# EAGLE design Teensy3.6Breakout (EAGLE 8.7.0)
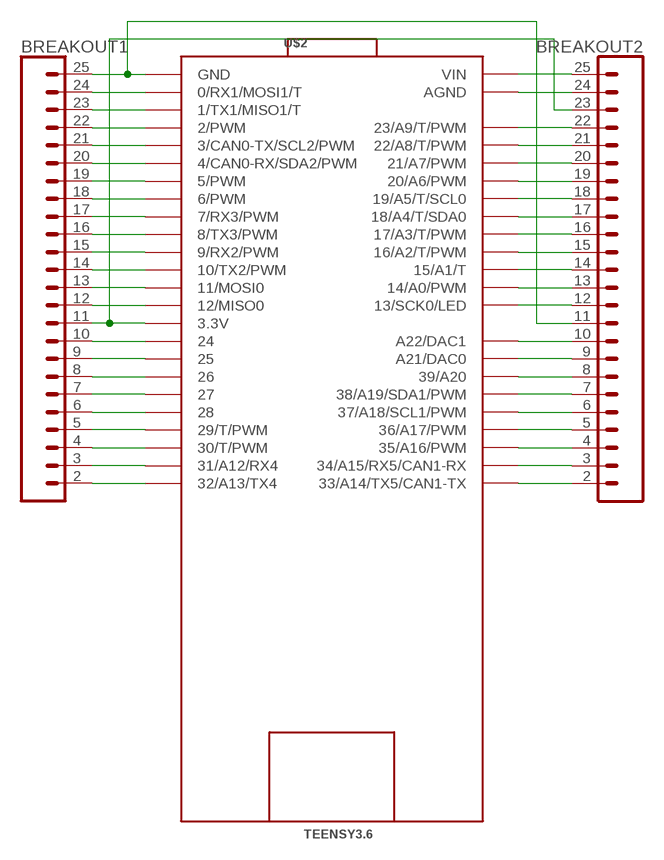
[diagram p0: schematic, sheet 1]

## Parts
BREAKOUT1  CONN_24LONGPADS  [1X24_LONGPADS]
BREAKOUT2  CONN_24LONGPADS  [1X24_LONGPADS]
U$2  TEENSY3.6  [TEENSY3.6]

## Nets
N$1: BREAKOUT1.25 BREAKOUT2.11 U$2.GND U$2.GND1(GND)
N$2: BREAKOUT1.24 U$2.0(0/RX1/MOSI1/T)
N$3: BREAKOUT1.23 U$2.1(1/TX1/MISO1/T)
N$4: BREAKOUT1.22 U$2.2(2/PWM)
N$5: BREAKOUT1.21 U$2.3(3/CAN0-TX/SCL2/PWM)
N$6: BREAKOUT1.20 U$2.4(4/CAN0-RX/SDA2/PWM)
N$7: BREAKOUT1.19 U$2.5(5/PWM)
N$8: BREAKOUT1.18 U$2.6(6/PWM)
N$9: BREAKOUT1.17 U$2.7(7/RX3/PWM)
N$10: BREAKOUT1.16 U$2.8(8/TX3/PWM)
N$11: BREAKOUT1.15 U$2.9(9/RX2/PWM)
N$12: BREAKOUT1.14 U$2.10(10/TX2/PWM)
N$13: BREAKOUT1.13 U$2.11(11/MOSI0)
N$14: BREAKOUT1.12 U$2.12(12/MISO0)
N$15: BREAKOUT1.11 BREAKOUT2.23 U$2.3.3V U$2.3.3V3(3.3V)
N$16: BREAKOUT1.10 U$2.24
N$17: BREAKOUT1.9 U$2.25
N$18: BREAKOUT1.8 U$2.26
N$19: BREAKOUT1.7 U$2.27
N$20: BREAKOUT1.6 U$2.28
N$21: BREAKOUT1.5 U$2.29(29/T/PWM)
N$22: BREAKOUT1.4 U$2.30(30/T/PWM)
N$23: BREAKOUT1.3 U$2.31/A12(31/A12/RX4)
N$24: BREAKOUT1.2 U$2.32/A13(32/A13/TX4)
N$25: BREAKOUT2.8 U$2.39/A20
N$26: BREAKOUT2.7 U$2.38/A19(38/A19/SDA1/PWM)
N$27: BREAKOUT2.6 U$2.37/A18(37/A18/SCL1/PWM)
N$28: BREAKOUT2.5 U$2.36/A17(36/A17/PWM)
N$29: BREAKOUT2.4 U$2.35/A16(35/A16/PWM)
N$30: BREAKOUT2.3 U$2.34/A15(34/A15/RX5/CAN1-RX)
N$31: BREAKOUT2.2 U$2.33/A14(33/A14/TX5/CAN1-TX)
N$32: BREAKOUT2.9 U$2.A21(A21/DAC0)
N$33: BREAKOUT2.10 U$2.A22(A22/DAC1)
N$34: BREAKOUT2.12 U$2.13(13/SCK0/LED)
N$35: BREAKOUT2.13 U$2.14/A0(14/A0/PWM)
N$36: BREAKOUT2.14 U$2.15/A1(15/A1/T)
N$37: BREAKOUT2.15 U$2.16/A2(16/A2/T/PWM)
N$38: BREAKOUT2.16 U$2.17/A3(17/A3/T/PWM)
N$39: BREAKOUT2.17 U$2.18/A4(18/A4/T/SDA0)
N$40: BREAKOUT2.18 U$2.19/A5(19/A5/T/SCL0)
N$41: BREAKOUT2.19 U$2.20/A6(20/A6/PWM)
N$42: BREAKOUT2.20 U$2.21/A7(21/A7/PWM)
N$43: BREAKOUT2.21 U$2.22/A8(22/A8/T/PWM)
N$44: BREAKOUT2.22 U$2.23/A9(23/A9/T/PWM)
N$45: BREAKOUT2.24 U$2.AGND
N$46: BREAKOUT2.25 U$2.P$1(VIN) U$2.VIN

## Library data of the parts
BREAKOUT1 BREAKOUT2 = SparkFun-Connectors:CONN_24: Multi connection point. Often used as Generic Header-pin footprint for 0.1 inch spaced/style header connections On any of the 0.1 inch spaced packages, you can populate with these: Break Away Headers - Straight <https://www.sparkfun.com/products/116> (PRT-00116) Break Away Male Headers - Right Angle <https://www.sparkfun.com/products/553> (PRT-00553) Female Headers <https://www.sparkfun.com/products/115> (PRT-00115) Break Away Headers - Machine Pin <https://www.sparkfun.com/products/117> (PRT-00117) Break Away Female Headers - Swiss Machine Pin <https://www.sparkfun.com/products/743> (PRT-00743) For SCREWTERMINALS and SPRING TERMINALS visit here: Screw Terimnals on SparkFun.com <https://www.sparkfun.com/search/results?term=Screw+Terminals> (5mm/3.5mm/2.54mm spacing) This device is also useful as a general connection point to wire up your design to another part of your project. Our various solder wires solder well into these plated through hole pads. Hook-Up Wire - Assortment (Stranded, 22 AWG) <https://www.sparkfun.com/products/11375> (PRT-11375) Hook-Up Wire - Assortment (Solid Core, 22 AWG) <https://www.sparkfun.com/products/11367> (PRT-11367) View the entire wire category on our website here <https://www.sparkfun.com/categories/141> Special notes: Molex polarized connector foot print use with SKU : PRT-08231 with associated crimp pins and housings. 1MM SMD Version SKU: PRT-10208 NOTES ON THE VARIANTS LOCK and LOCK_LONGPADS... This footprint was designed to help hold the alignment of a through-hole component (i.e. 6-pin header) while soldering it into place. You may notice that each hole has been shifted either up or down by 0.005 of an inch from it's more standard position (which is a perfectly straight line). This slight alteration caused the pins (the squares in the middle) to touch the edges of the holes. Because they are alternating, it causes a "brace" to hold the component in place. 0.005 has proven to be the perfect amount of "off-center" position when using our standard breakaway headers. Although looks a little odd when you look at the bare footprint, once you have a header in there, the alteration is very hard to notice. Also,if you push a header all the way into place, it is covered up entirely on the bottom side.
U$2 = Teensy_3_and_LC_Series_Boards_v1.4:TEENSY3.6

## Board
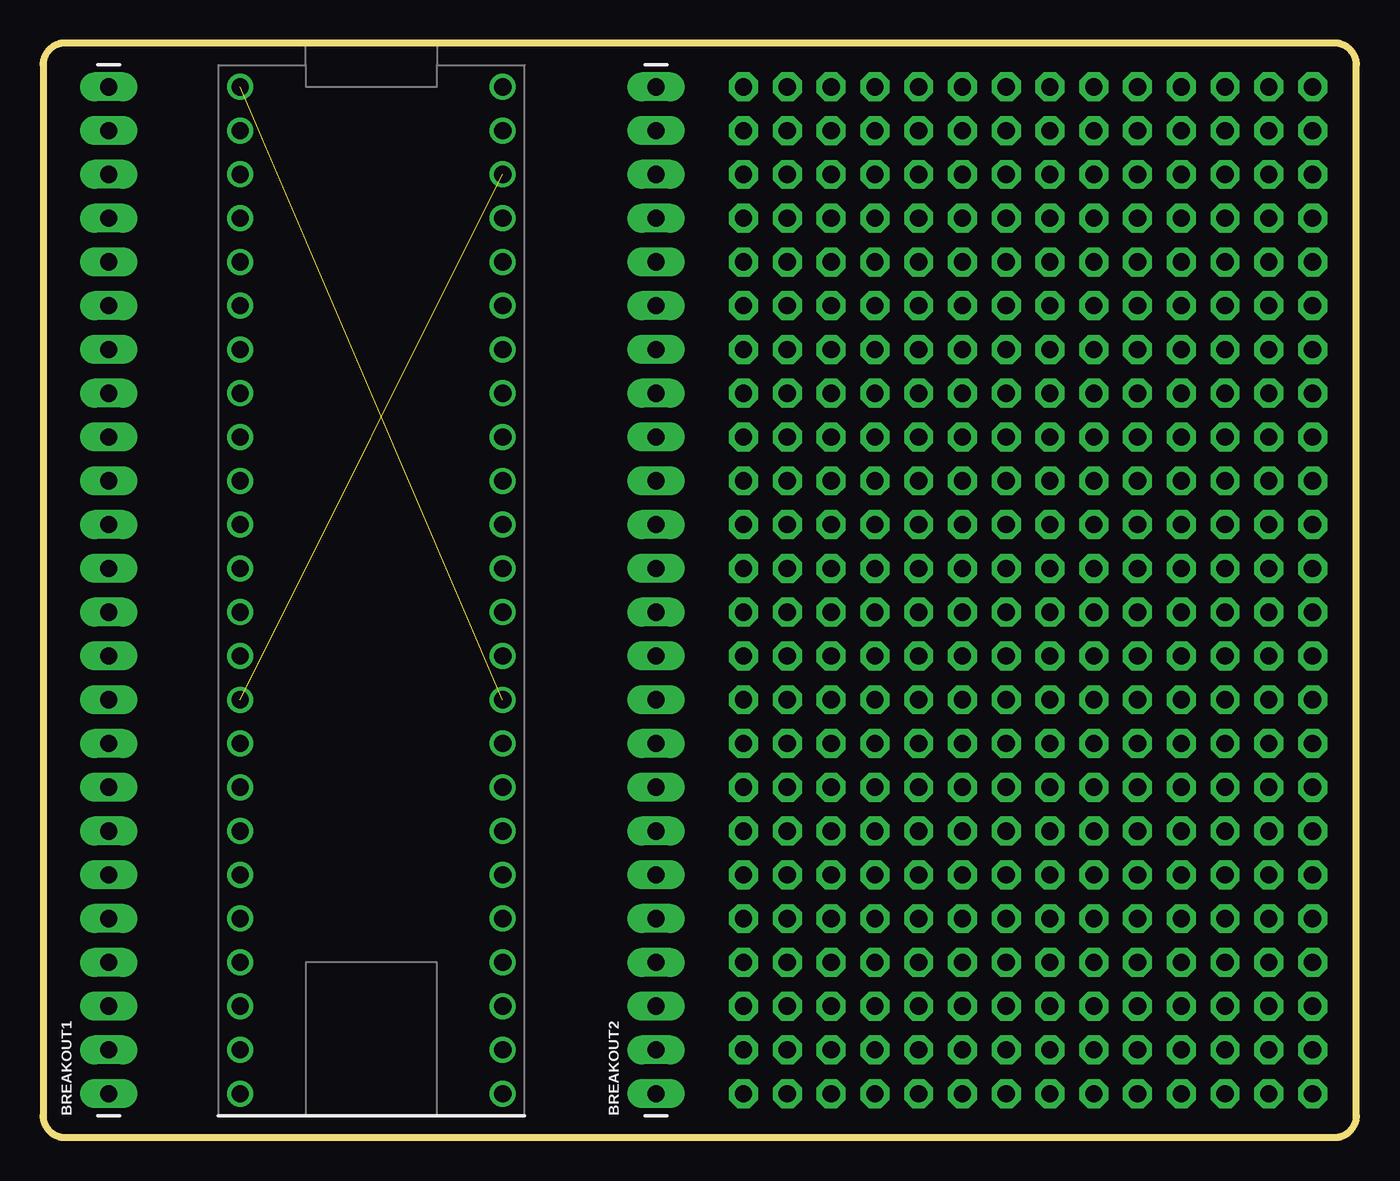
[diagram p1: board, top side]
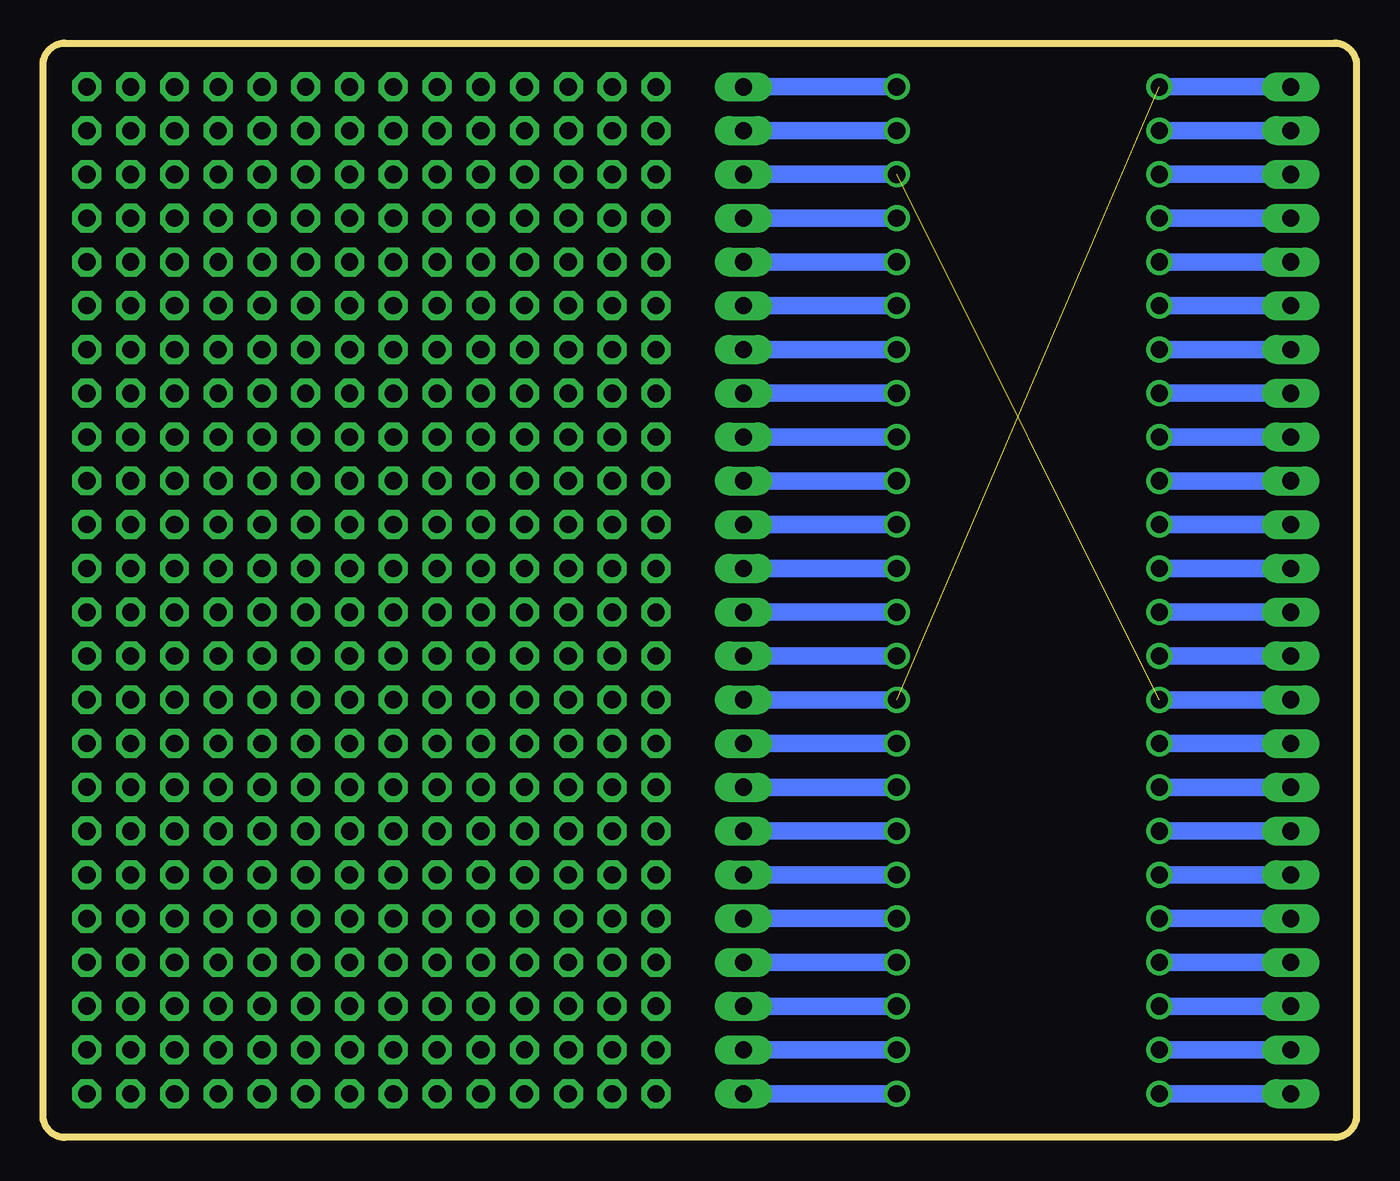
[diagram p2: board, bottom side, seen from below]

Size 76.2 x 63.5 mm. Coordinates in mm from the lower left corner, seen from the top.
Outline: 0,62.23 0,1.27 arc90 1.27,0 74.93,0 arc90 76.2,1.27 76.2,62.23 arc90 74.93,63.5 1.27,63.5 arc90 0,62.23
Copper layers (1*16): Top 0.035mm / dielectric 1.5mm / Bottom 0.035mm
Design rules "default": minimum track width 6mil, minimum drill 0.35mm, track to track 6mil, track to pad 6mil, pad to pad 6mil, via to via 6mil, smd to smd 6mil, copper to edge 40mil, drill to drill 6mil, minimum pad ring 10mil, minimum via ring 8mil, stop-mask expansion 4mil, vias tented up to drill 0mil, thermal gap 10mil

### Footprints (pad centres in the part's own frame; a part is rotated, then mirrored left to right if it is on the bottom)
1X24_LONGPADS = drill 1 pad 1.676 long: 2 -26.67,0; 3 -24.13,0; 4 -21.59,0; 5 -19.05,0; 6 -16.51,0; 7 -13.97,0; 8 -11.43,0; 9 -8.89,0; 10 -6.35,0; 11 -3.81,0; 12 -1.27,0; 13 1.27,0; 14 3.81,0; 15 6.35,0; 16 8.89,0; 17 11.43,0; 18 13.97,0; 19 16.51,0; 20 19.05,0; 21 21.59,0; 22 24.13,0; 23 26.67,0; 24 29.21,0; 25 31.75,0
TEENSY3.6 = drill 1: 0 -7.62,19.05; 1 -7.62,16.51; 2 -7.62,13.97; 3 -7.62,11.43; 3.3V 7.62,16.51; 3.3V3 -7.62,-13.97; 4 -7.62,8.89; 5 -7.62,6.35; 6 -7.62,3.81; 7 -7.62,1.27; 8 -7.62,-1.27; 9 -7.62,-3.81; 10 -7.62,-6.35; 11 -7.62,-8.89; 12 -7.62,-11.43; 13 7.62,-11.43; 14/A0 7.62,-8.89; 15/A1 7.62,-6.35; 16/A2 7.62,-3.81; 17/A3 7.62,-1.27; 18/A4 7.62,1.27; 19/A5 7.62,3.81; 20/A6 7.62,6.35; 21/A7 7.62,8.89; 22/A8 7.62,11.43; 23/A9 7.62,13.97; 24 -7.62,-16.51; 25 -7.62,-19.05; 26 -7.62,-21.59; 27 -7.62,-24.13; 28 -7.62,-26.67; 29 -7.62,-29.21; 30 -7.62,-31.75; 31/A12 -7.62,-34.29; 32/A13 -7.62,-36.83; 33/A14 7.62,-36.83; 34/A15 7.62,-34.29; 35/A16 7.62,-31.75; 36/A17 7.62,-29.21; 37/A18 7.62,-26.67; 38/A19 7.62,-24.13; 39/A20 7.62,-21.59; A21 7.62,-19.05; A22 7.62,-16.51; AGND 7.62,19.05; GND -7.62,21.59; GND1 7.62,-13.97; VIN 7.62,21.59 | drill 1 pad 1.676 octagon: P$1 21.59,21.59; P$2 24.13,21.59; P$3 26.67,21.59; P$4 29.21,21.59; P$5 31.75,21.59; P$6 34.29,21.59; P$7 36.83,21.59; P$8 39.37,21.59; P$9 41.91,21.59; P$10 44.45,21.59; P$11 46.99,21.59; P$12 49.53,21.59; P$13 52.07,21.59; P$14 54.61,21.59; P$15 21.59,19.05; P$16 24.13,19.05; P$17 26.67,19.05; P$18 29.21,19.05; P$19 31.75,19.05; P$20 34.29,19.05; P$21 36.83,19.05; P$22 39.37,19.05; P$23 41.91,19.05; P$24 44.45,19.05; P$25 46.99,19.05; P$26 49.53,19.05; P$27 52.07,19.05; P$28 54.61,19.05; P$29 21.59,16.51; P$30 24.13,16.51; P$31 26.67,16.51; P$32 29.21,16.51; P$33 31.75,16.51; P$34 34.29,16.51; P$35 36.83,16.51; P$36 39.37,16.51; P$37 41.91,16.51; P$38 44.45,16.51; P$39 46.99,16.51; P$40 49.53,16.51; P$41 52.07,16.51; P$42 54.61,16.51; P$43 21.59,13.97; P$44 24.13,13.97; P$45 26.67,13.97; P$46 29.21,13.97; P$47 31.75,13.97; P$48 34.29,13.97; P$49 36.83,13.97; P$50 39.37,13.97; P$51 41.91,13.97; P$52 44.45,13.97; P$53 46.99,13.97; P$54 49.53,13.97; P$55 52.07,13.97; P$56 54.61,13.97; P$57 21.59,11.43; P$58 24.13,11.43; P$59 26.67,11.43; P$60 29.21,11.43; P$61 31.75,11.43; P$62 34.29,11.43; P$63 36.83,11.43; P$64 39.37,11.43; P$65 41.91,11.43; P$66 44.45,11.43; P$67 46.99,11.43; P$68 49.53,11.43; P$69 52.07,11.43; P$70 54.61,11.43; P$71 21.59,8.89; P$72 24.13,8.89; P$73 26.67,8.89; P$74 29.21,8.89; P$75 31.75,8.89; P$76 34.29,8.89; P$77 36.83,8.89; P$78 39.37,8.89; P$79 41.91,8.89; P$80 44.45,8.89; P$81 46.99,8.89; P$82 49.53,8.89; P$83 52.07,8.89; P$84 54.61,8.89; P$85 21.59,6.35; P$86 24.13,6.35; P$87 26.67,6.35; P$88 29.21,6.35; P$89 31.75,6.35; P$90 34.29,6.35; P$91 36.83,6.35; P$92 39.37,6.35; P$93 41.91,6.35; P$94 44.45,6.35; P$95 46.99,6.35; P$96 49.53,6.35; P$97 52.07,6.35; P$98 54.61,6.35; P$99 21.59,3.81; P$100 24.13,3.81; P$101 26.67,3.81; P$102 29.21,3.81; P$103 31.75,3.81; P$104 34.29,3.81; P$105 36.83,3.81; P$106 39.37,3.81; P$107 41.91,3.81; P$108 44.45,3.81; P$109 46.99,3.81; P$110 49.53,3.81; P$111 52.07,3.81; P$112 54.61,3.81; P$113 21.59,1.27; P$114 24.13,1.27; P$115 26.67,1.27; P$116 29.21,1.27; P$117 31.75,1.27; P$118 34.29,1.27; P$119 36.83,1.27; P$120 39.37,1.27; P$121 41.91,1.27; P$122 44.45,1.27; P$123 46.99,1.27; P$124 49.53,1.27; P$125 52.07,1.27; P$126 54.61,1.27; P$127 21.59,-1.27; P$128 24.13,-1.27; P$129 26.67,-1.27; P$130 29.21,-1.27; P$131 31.75,-1.27; P$132 34.29,-1.27; P$133 36.83,-1.27; P$134 39.37,-1.27; P$135 41.91,-1.27; P$136 44.45,-1.27; P$137 46.99,-1.27; P$138 49.53,-1.27; P$139 52.07,-1.27; P$140 54.61,-1.27; P$141 21.59,-3.81; P$142 24.13,-3.81; P$143 26.67,-3.81; P$144 29.21,-3.81; P$145 31.75,-3.81; P$146 34.29,-3.81; P$147 36.83,-3.81; P$148 39.37,-3.81; P$149 41.91,-3.81; P$150 44.45,-3.81; P$151 46.99,-3.81; P$152 49.53,-3.81; P$153 52.07,-3.81; P$154 54.61,-3.81; P$155 21.59,-6.35; P$156 24.13,-6.35; P$157 26.67,-6.35; P$158 29.21,-6.35; P$159 31.75,-6.35; P$160 34.29,-6.35; P$161 36.83,-6.35; P$162 39.37,-6.35; P$163 41.91,-6.35; P$164 44.45,-6.35; P$165 46.99,-6.35; P$166 49.53,-6.35; P$167 52.07,-6.35; P$168 54.61,-6.35; P$169 21.59,-8.89; P$170 24.13,-8.89; P$171 26.67,-8.89; P$172 29.21,-8.89; P$173 31.75,-8.89; P$174 34.29,-8.89; P$175 36.83,-8.89; P$176 39.37,-8.89; P$177 41.91,-8.89; P$178 44.45,-8.89; P$179 46.99,-8.89; P$180 49.53,-8.89; P$181 52.07,-8.89; P$182 54.61,-8.89; P$183 21.59,-11.43; P$184 24.13,-11.43; P$185 26.67,-11.43; P$186 29.21,-11.43; P$187 31.75,-11.43; P$188 34.29,-11.43; P$189 36.83,-11.43; P$190 39.37,-11.43; P$191 41.91,-11.43; P$192 44.45,-11.43; P$193 46.99,-11.43; P$194 49.53,-11.43; P$195 52.07,-11.43; P$196 54.61,-11.43; P$197 21.59,-13.97; P$198 24.13,-13.97; P$199 26.67,-13.97; P$200 29.21,-13.97; P$201 31.75,-13.97; P$202 34.29,-13.97; P$203 36.83,-13.97; P$204 39.37,-13.97; P$205 41.91,-13.97; P$206 44.45,-13.97; P$207 46.99,-13.97; P$208 49.53,-13.97; P$209 52.07,-13.97; P$210 54.61,-13.97; P$211 21.59,-16.51; P$212 24.13,-16.51; P$213 26.67,-16.51; P$214 29.21,-16.51; P$215 31.75,-16.51; P$216 34.29,-16.51; P$217 36.83,-16.51; P$218 39.37,-16.51; P$219 41.91,-16.51; P$220 44.45,-16.51; P$221 46.99,-16.51; P$222 49.53,-16.51; P$223 52.07,-16.51; P$224 54.61,-16.51; P$225 21.59,-19.05; P$226 24.13,-19.05; P$227 26.67,-19.05; P$228 29.21,-19.05; P$229 31.75,-19.05; P$230 34.29,-19.05; P$231 36.83,-19.05; P$232 39.37,-19.05; P$233 41.91,-19.05; P$234 44.45,-19.05; P$235 46.99,-19.05; P$236 49.53,-19.05; P$237 52.07,-19.05; P$238 54.61,-19.05; P$239 21.59,-21.59; P$240 24.13,-21.59; P$241 26.67,-21.59; P$242 29.21,-21.59; P$243 31.75,-21.59; P$244 34.29,-21.59; P$245 36.83,-21.59; P$246 39.37,-21.59; P$247 41.91,-21.59; P$248 44.45,-21.59; P$249 46.99,-21.59; P$250 49.53,-21.59; P$251 52.07,-21.59; P$252 54.61,-21.59; P$253 21.59,-24.13; P$254 24.13,-24.13; P$255 26.67,-24.13; P$256 29.21,-24.13; P$257 31.75,-24.13; P$258 34.29,-24.13; P$259 36.83,-24.13; P$260 39.37,-24.13; P$261 41.91,-24.13; P$262 44.45,-24.13; P$263 46.99,-24.13; P$264 49.53,-24.13; P$265 52.07,-24.13; P$266 54.61,-24.13; P$267 21.59,-26.67; P$268 24.13,-26.67; P$269 26.67,-26.67; P$270 29.21,-26.67; P$271 31.75,-26.67; P$272 34.29,-26.67; P$273 36.83,-26.67; P$274 39.37,-26.67; P$275 41.91,-26.67; P$276 44.45,-26.67; P$277 46.99,-26.67; P$278 49.53,-26.67; P$279 52.07,-26.67; P$280 54.61,-26.67; P$281 21.59,-29.21; P$282 24.13,-29.21; P$283 26.67,-29.21; P$284 29.21,-29.21; P$285 31.75,-29.21; P$286 34.29,-29.21; P$287 36.83,-29.21; P$288 39.37,-29.21; P$289 41.91,-29.21; P$290 44.45,-29.21; P$291 46.99,-29.21; P$292 49.53,-29.21; P$293 52.07,-29.21; P$294 54.61,-29.21; P$295 21.59,-31.75; P$296 24.13,-31.75; P$297 26.67,-31.75; P$298 29.21,-31.75; P$299 31.75,-31.75; P$300 34.29,-31.75; P$301 36.83,-31.75; P$302 39.37,-31.75; P$303 41.91,-31.75; P$304 44.45,-31.75; P$305 46.99,-31.75; P$306 49.53,-31.75; P$307 52.07,-31.75; P$308 54.61,-31.75; P$309 21.59,-34.29; P$310 24.13,-34.29; P$311 26.67,-34.29; P$312 29.21,-34.29; P$313 31.75,-34.29; P$314 34.29,-34.29; P$315 36.83,-34.29; P$316 39.37,-34.29; P$317 41.91,-34.29; P$318 44.45,-34.29; P$319 46.99,-34.29; P$320 49.53,-34.29; P$321 52.07,-34.29; P$322 54.61,-34.29; P$323 21.59,-36.83; P$324 24.13,-36.83; P$325 26.67,-36.83; P$326 29.21,-36.83; P$327 31.75,-36.83; P$328 34.29,-36.83; P$329 36.83,-36.83; P$330 39.37,-36.83; P$331 41.91,-36.83; P$332 44.45,-36.83; P$333 46.99,-36.83; P$334 49.53,-36.83; P$335 52.07,-36.83; P$336 54.61,-36.83

### Placement (x,y rotation side)
BREAKOUT1  3.81,29.21 90 top
BREAKOUT2  35.56,29.21 90 top
U$2  19.05,39.37 0 top

### Tracks (layer width: path | path; a pad name or v marks a point on that pad's centre or on a via)
N$1  (1 unrouted)
  Bottom 1.016: U$2.GND1 BREAKOUT2.11 | BREAKOUT1.25 U$2.GND
N$2
  Bottom 1.016: U$2.0 BREAKOUT1.24
N$3
  Bottom 1.016: BREAKOUT1.23 U$2.1
N$4
  Bottom 1.016: U$2.2 BREAKOUT1.22
N$5
  Bottom 1.016: BREAKOUT1.21 U$2.3
N$6
  Bottom 1.016: U$2.4 BREAKOUT1.20
N$7
  Bottom 1.016: BREAKOUT1.19 U$2.5
N$8
  Bottom 1.016: U$2.6 BREAKOUT1.18
N$9
  Bottom 1.016: BREAKOUT1.17 U$2.7
N$10
  Bottom 1.016: U$2.8 BREAKOUT1.16
N$11
  Bottom 1.016: BREAKOUT1.15 U$2.9
N$12
  Bottom 1.016: U$2.10 BREAKOUT1.14
N$13
  Bottom 1.016: BREAKOUT1.13 U$2.11
N$14
  Bottom 1.016: U$2.12 BREAKOUT1.12
N$15  (1 unrouted)
  Bottom 1.016: U$2.3.3V BREAKOUT2.23 | BREAKOUT1.11 U$2.3.3V3
N$16
  Bottom 1.016: BREAKOUT1.10 U$2.24
N$17
  Bottom 1.016: U$2.25 BREAKOUT1.9
N$18
  Bottom 1.016: U$2.26 BREAKOUT1.8
N$19
  Bottom 1.016: BREAKOUT1.7 U$2.27
N$20
  Bottom 1.016: U$2.28 BREAKOUT1.6
N$21
  Bottom 1.016: BREAKOUT1.5 U$2.29
N$22
  Bottom 1.016: U$2.30 BREAKOUT1.4
N$23
  Bottom 1.016: BREAKOUT1.3 U$2.31/A12
N$24
  Bottom 1.016: U$2.32/A13 BREAKOUT1.2
N$25
  Bottom 1.016: U$2.39/A20 BREAKOUT2.8
N$26
  Bottom 1.016: BREAKOUT2.7 U$2.38/A19
N$27
  Bottom 1.016: U$2.37/A18 BREAKOUT2.6
N$28
  Bottom 1.016: BREAKOUT2.5 U$2.36/A17
N$29
  Bottom 1.016: U$2.35/A16 BREAKOUT2.4
N$30
  Bottom 1.016: BREAKOUT2.3 U$2.34/A15
N$31
  Bottom 1.016: U$2.33/A14 BREAKOUT2.2
N$32
  Bottom 1.016: BREAKOUT2.9 U$2.A21
N$33
  Bottom 1.016: U$2.A22 BREAKOUT2.10
N$34
  Bottom 1.016: BREAKOUT2.12 U$2.13
N$35
  Bottom 1.016: U$2.14/A0 BREAKOUT2.13
N$36
  Bottom 1.016: BREAKOUT2.14 U$2.15/A1
N$37
  Bottom 1.016: U$2.16/A2 BREAKOUT2.15
N$38
  Bottom 1.016: BREAKOUT2.16 U$2.17/A3
N$39
  Bottom 1.016: U$2.18/A4 BREAKOUT2.17
N$40
  Bottom 1.016: BREAKOUT2.18 U$2.19/A5
N$41
  Bottom 1.016: U$2.20/A6 BREAKOUT2.19
N$42
  Bottom 1.016: BREAKOUT2.20 U$2.21/A7
N$43
  Bottom 1.016: U$2.22/A8 BREAKOUT2.21
N$44
  Bottom 1.016: BREAKOUT2.22 U$2.23/A9
N$45
  Bottom 1.016: BREAKOUT2.24 U$2.AGND
N$46
  Bottom 1.016: U$2.VIN BREAKOUT2.25